# EAGLE design black_barrier (EAGLE 9.6.0)
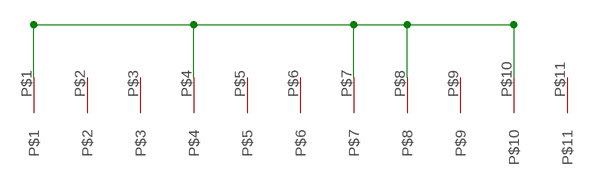
[diagram p0: schematic, sheet 1]

## Parts
U$1  ADVCHIP  [ADCHIP]

## Nets
N$6: U$1.P$1 U$1.P$4 U$1.P$7 U$1.P$8 U$1.P$10
Unconnected: U$1.P$2 U$1.P$3 U$1.P$5 U$1.P$6 U$1.P$9 U$1.P$11

## Library data of the parts
U$1 = advpins:ADVCHIP

## Board
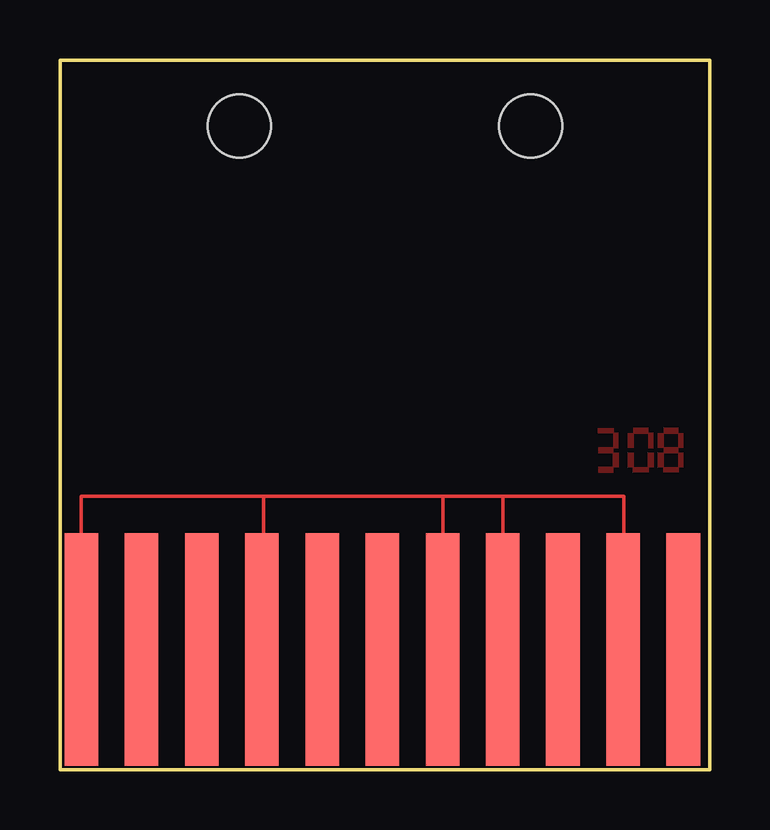
[diagram p1: board, top side]

Size 27.1 x 29.58 mm. Coordinates in mm from the lower left corner, seen from the top.
Outline: 0,29.58 0,0 27.1,0 27.1,29.58 0,29.58
Copper layers (1*16): Top 0.035mm / dielectric 1.5mm / Bottom 0.035mm
Design rules "default": minimum track width 6mil, minimum drill 0.35mm, track to track 6mil, track to pad 6mil, pad to pad 6mil, via to via 6mil, smd to smd 6mil, copper to edge 40mil, drill to drill 6mil, minimum pad ring 10mil, minimum via ring 8mil, stop-mask expansion 4mil, vias tented up to drill 0mil, thermal gap 10mil
Holes 2.62 mm at 7.48,26.83 19.62,26.83

### Footprints (pad centres in the part's own frame; a part is rotated, then mirrored left to right if it is on the bottom)
ADCHIP = smd 1.4 x 9.7: P$1 -27.61,5.02; P$2 -25.1,5.02; P$3 -22.59,5.02; P$4 -20.08,5.02; P$5 -17.57,5.02; P$6 -15.06,5.02; P$7 -12.55,5.02; P$8 -10.04,5.02; P$9 -7.53,5.02; P$10 -5.02,5.02; P$11 -2.51,5.02

### Placement (x,y rotation side)
U$1  28.5,0 0 top

### Tracks (layer width: path | path; a pad name or v marks a point on that pad's centre or on a via)
N$1
  pour Top: 23.06,14.04 22.45,14.04 22.45,14.24 23.06,14.24
N$2
  pour Top: 23.07,14.04 23.07,13.42 23.28,13.42 23.28,14.04
N$3
  pour Top: 22.45,13.42 22.45,13.22 23.06,13.22 23.06,13.42
N$4
  pour Top: 23.28,12.6 23.07,12.6 23.07,13.22 23.28,13.22
N$5
  pour Top: 22.45,12.6 22.45,12.4 23.06,12.4 23.06,12.6
N$6
  Top 0.152: U$1.P$1 0.89,11.4 8.49,11.4 | 8.49,11.4 15.96,11.4 | 18.4,5.03 U$1.P$8 18.46,11.4 | 8.49,11.4 8.49,5.03 U$1.P$4 | 15.96,11.4 U$1.P$7 | 23.43,5.03 U$1.P$10 23.5,11.4 18.46,11.4 | 15.96,11.4 18.46,11.4
N$7
  pour Top: 23.91,14.24 23.91,14.04 24.53,14.04 24.53,14.24
N$8
  pour Top: 23.9,13.42 23.7,13.42 23.7,14.04 23.9,14.04
N$9
  pour Top: 24.54,14.04 24.54,13.42 24.74,13.42 24.74,14.04
N$10
  pour Top: 23.9,12.6 23.7,12.6 23.7,13.22 23.9,13.22
N$11
  pour Top: 24.74,12.6 24.54,12.6 24.54,13.22 24.74,13.22
N$12
  pour Top: 24.53,12.4 23.91,12.4 23.91,12.6 24.53,12.6
N$13
  pour Top: 25.17,14.24 25.17,14.04 25.78,14.04 25.78,14.24
N$14
  pour Top: 25.16,13.42 24.95,13.42 24.95,14.04 25.16,14.04
N$15
  pour Top: 26,13.42 25.79,13.42 25.79,14.04 26,14.04
N$16
  pour Top: 25.17,13.42 25.17,13.22 25.78,13.22 25.78,13.42
N$17
  pour Top: 25.16,12.6 24.95,12.6 24.95,13.22 25.16,13.22
N$18
  pour Top: 26,12.6 25.79,12.6 25.79,13.22 26,13.22
N$19
  pour Top: 25.78,12.4 25.17,12.4 25.17,12.6 25.78,12.6